# Altium schematic sheet Sheet2.SchDoc
size A1; SheetNumber: 1; SheetTotal: 1
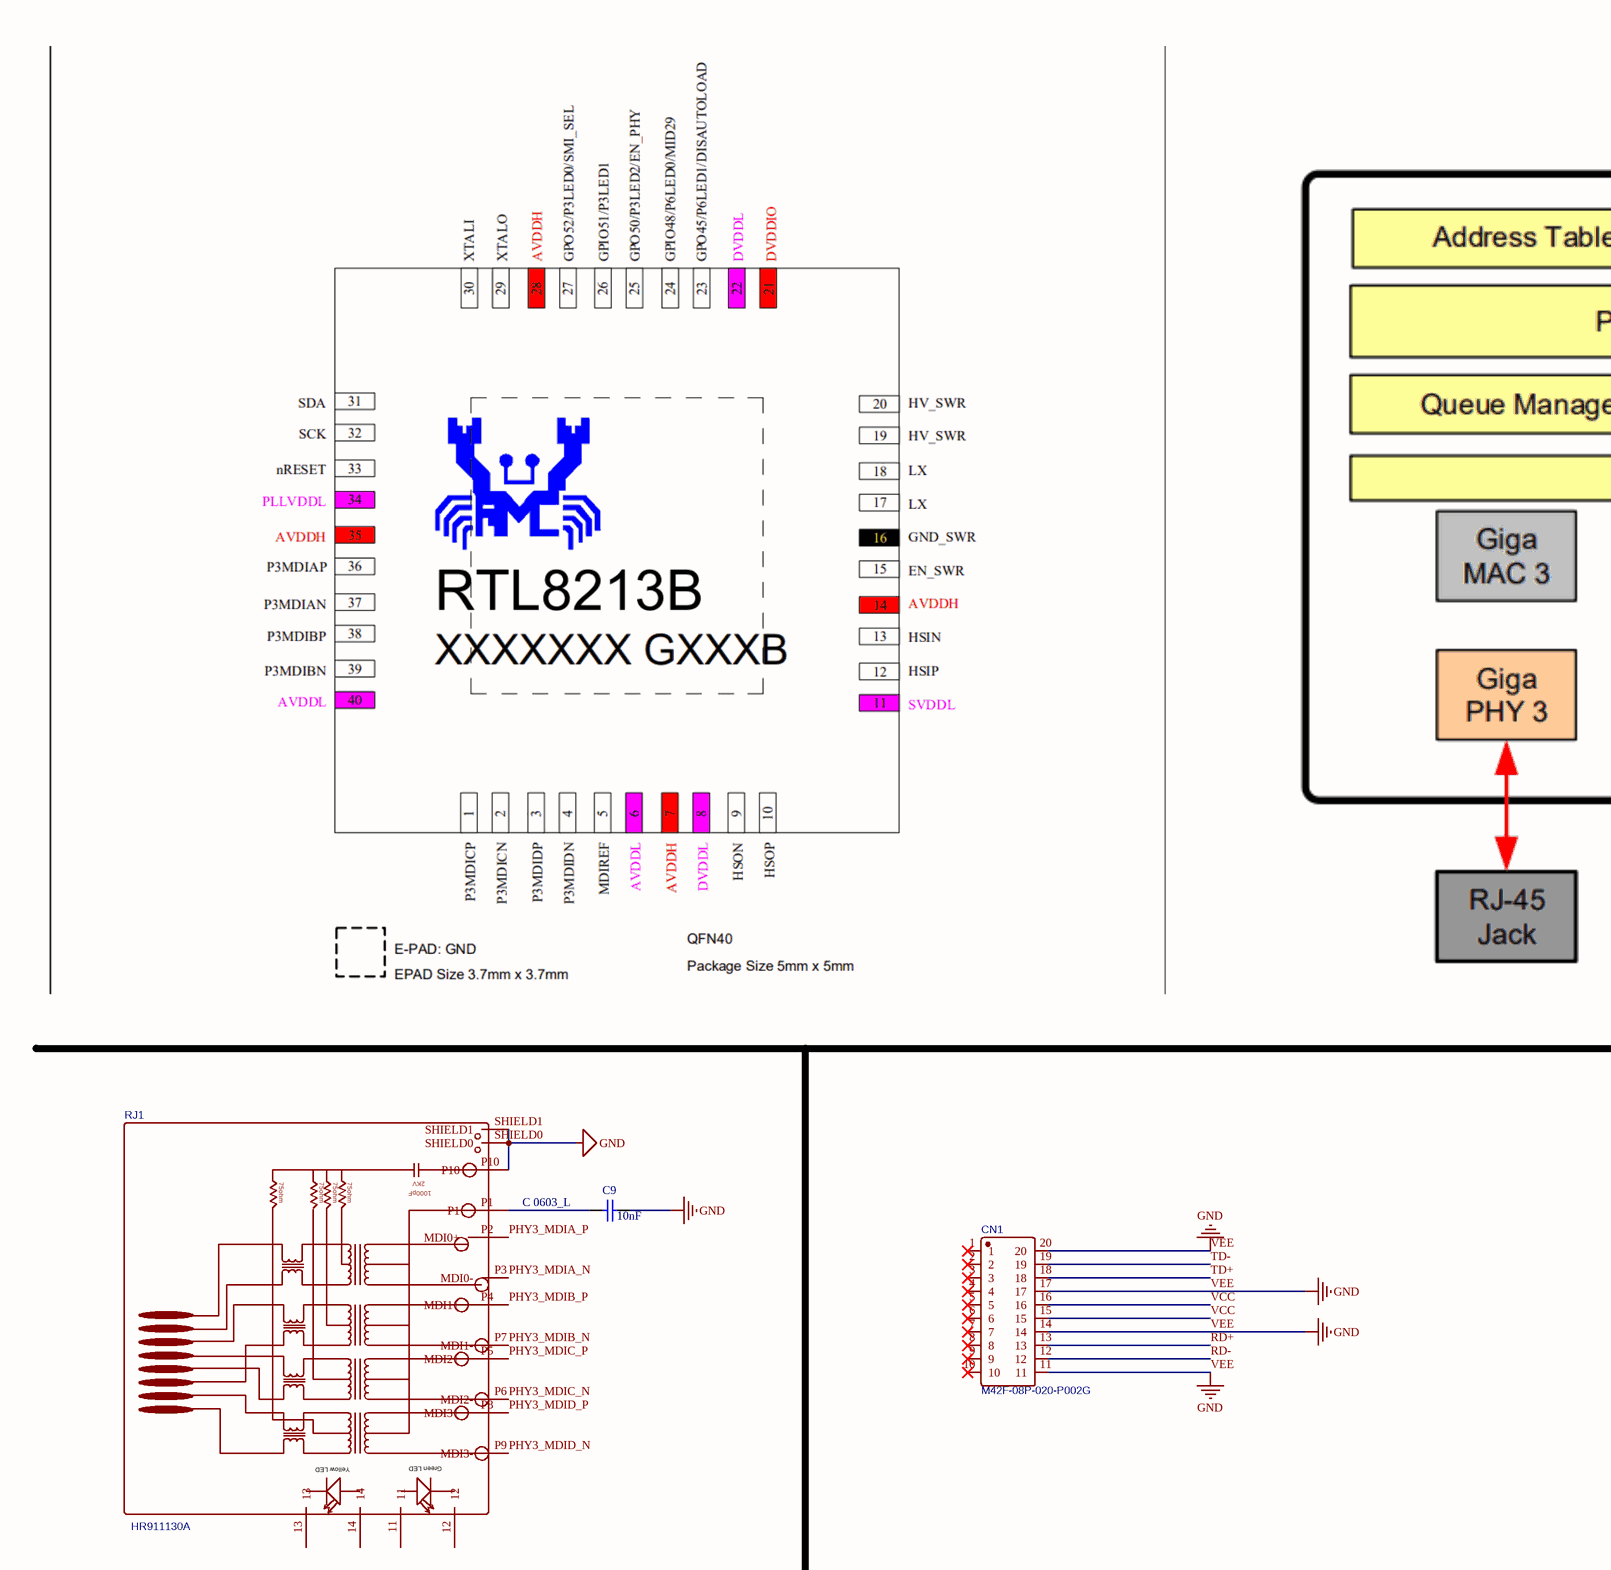
[diagram p0: Sheet2.SchDoc, top left]
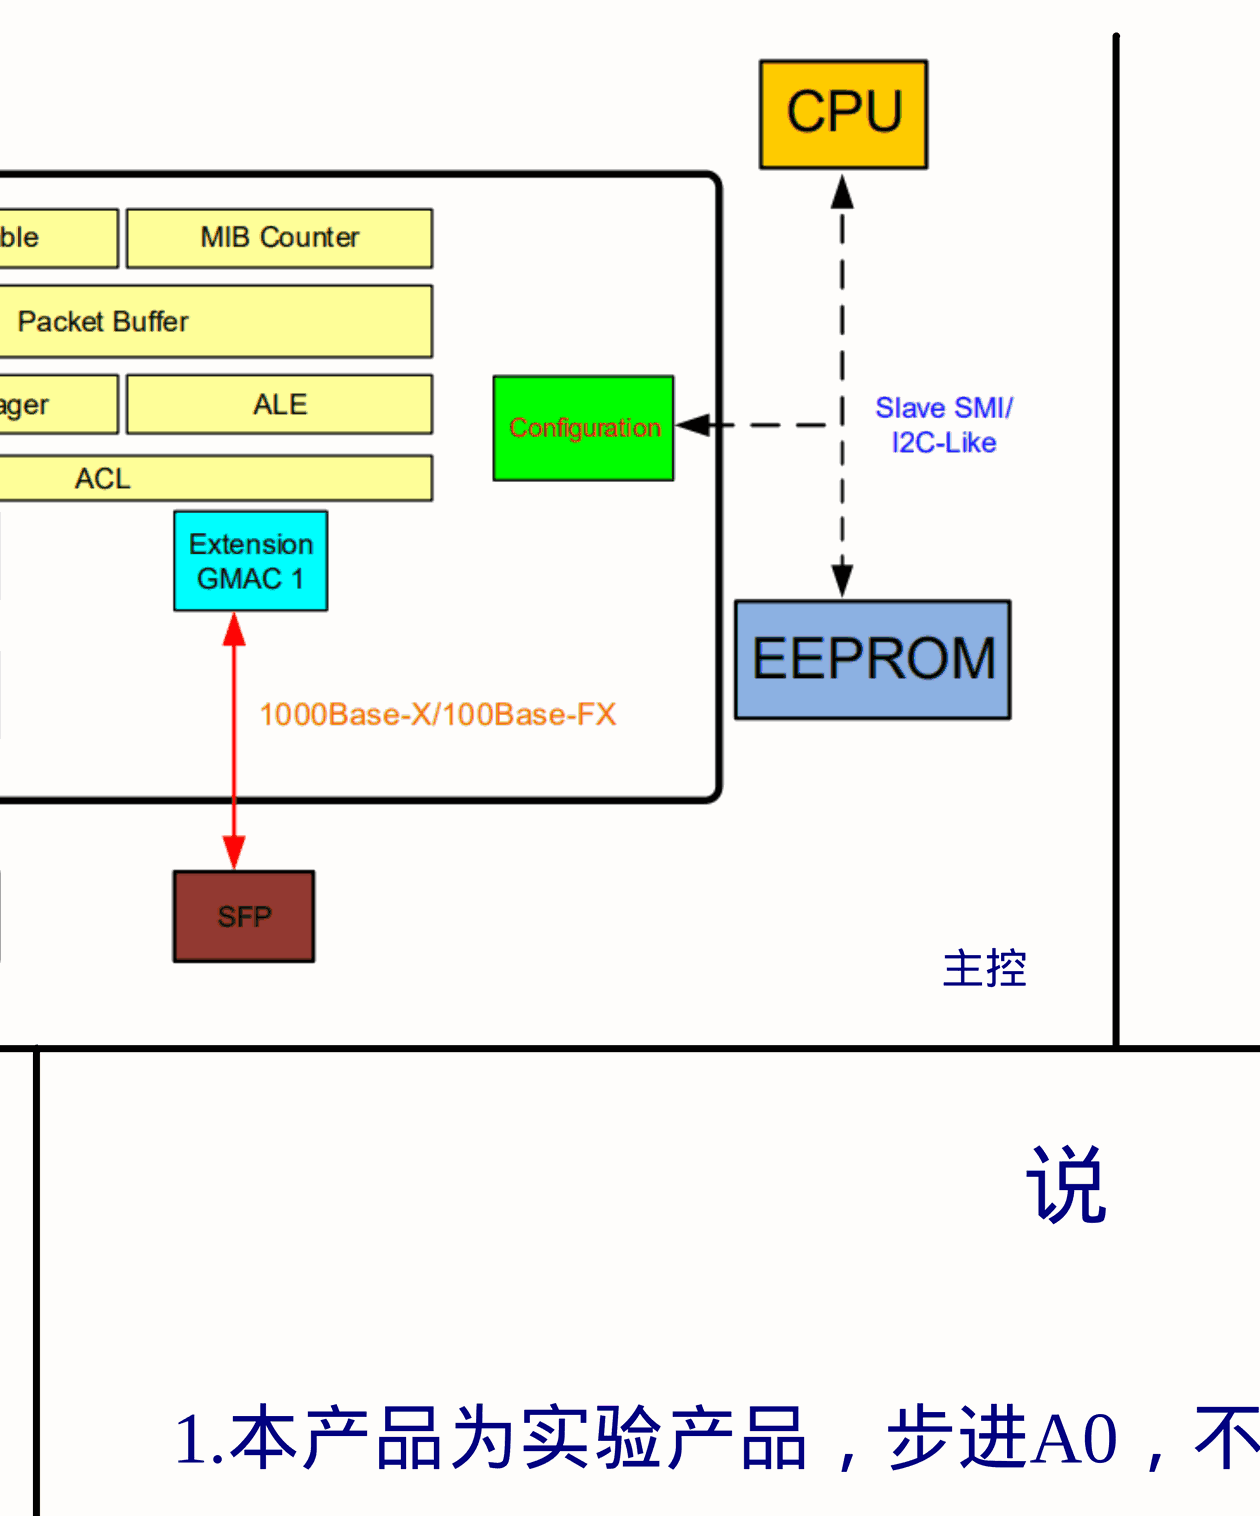
[diagram p1: Sheet2.SchDoc, top middle]
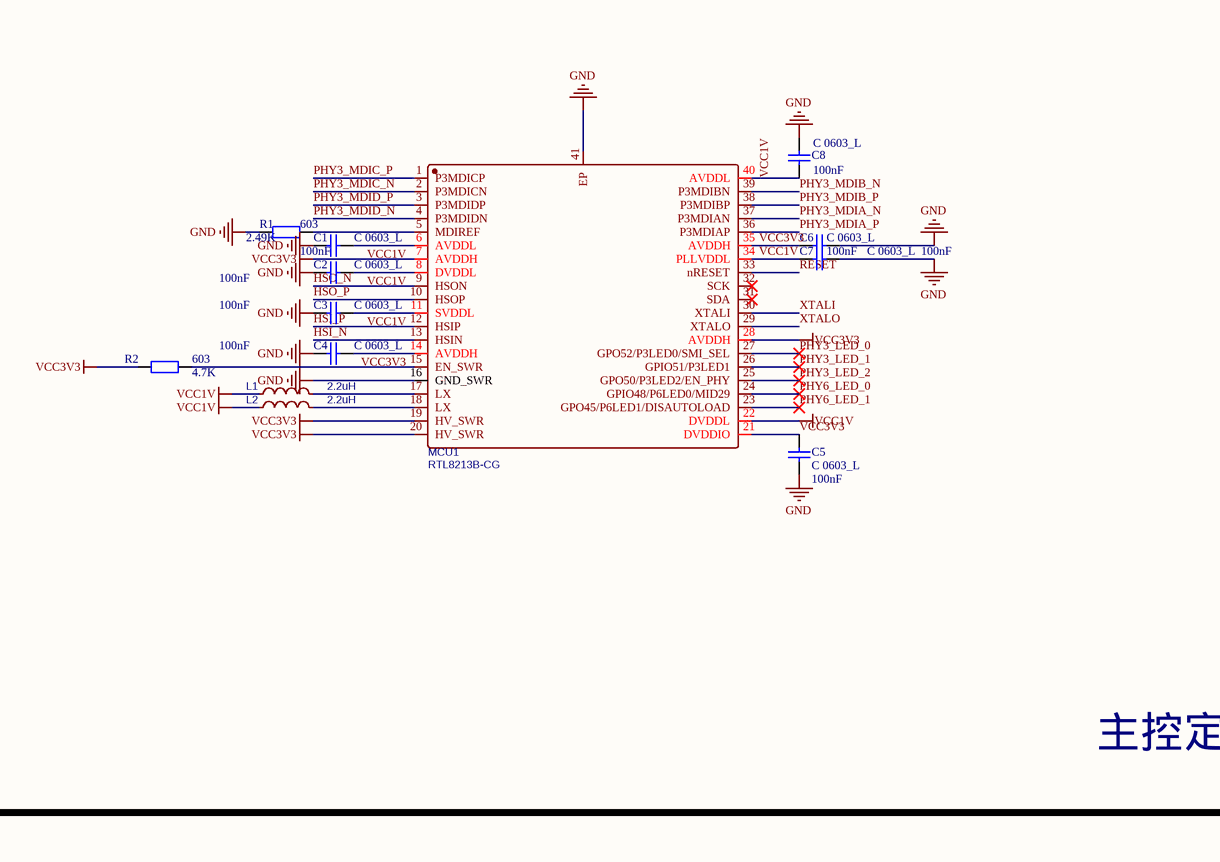
[diagram p2: Sheet2.SchDoc, top right]
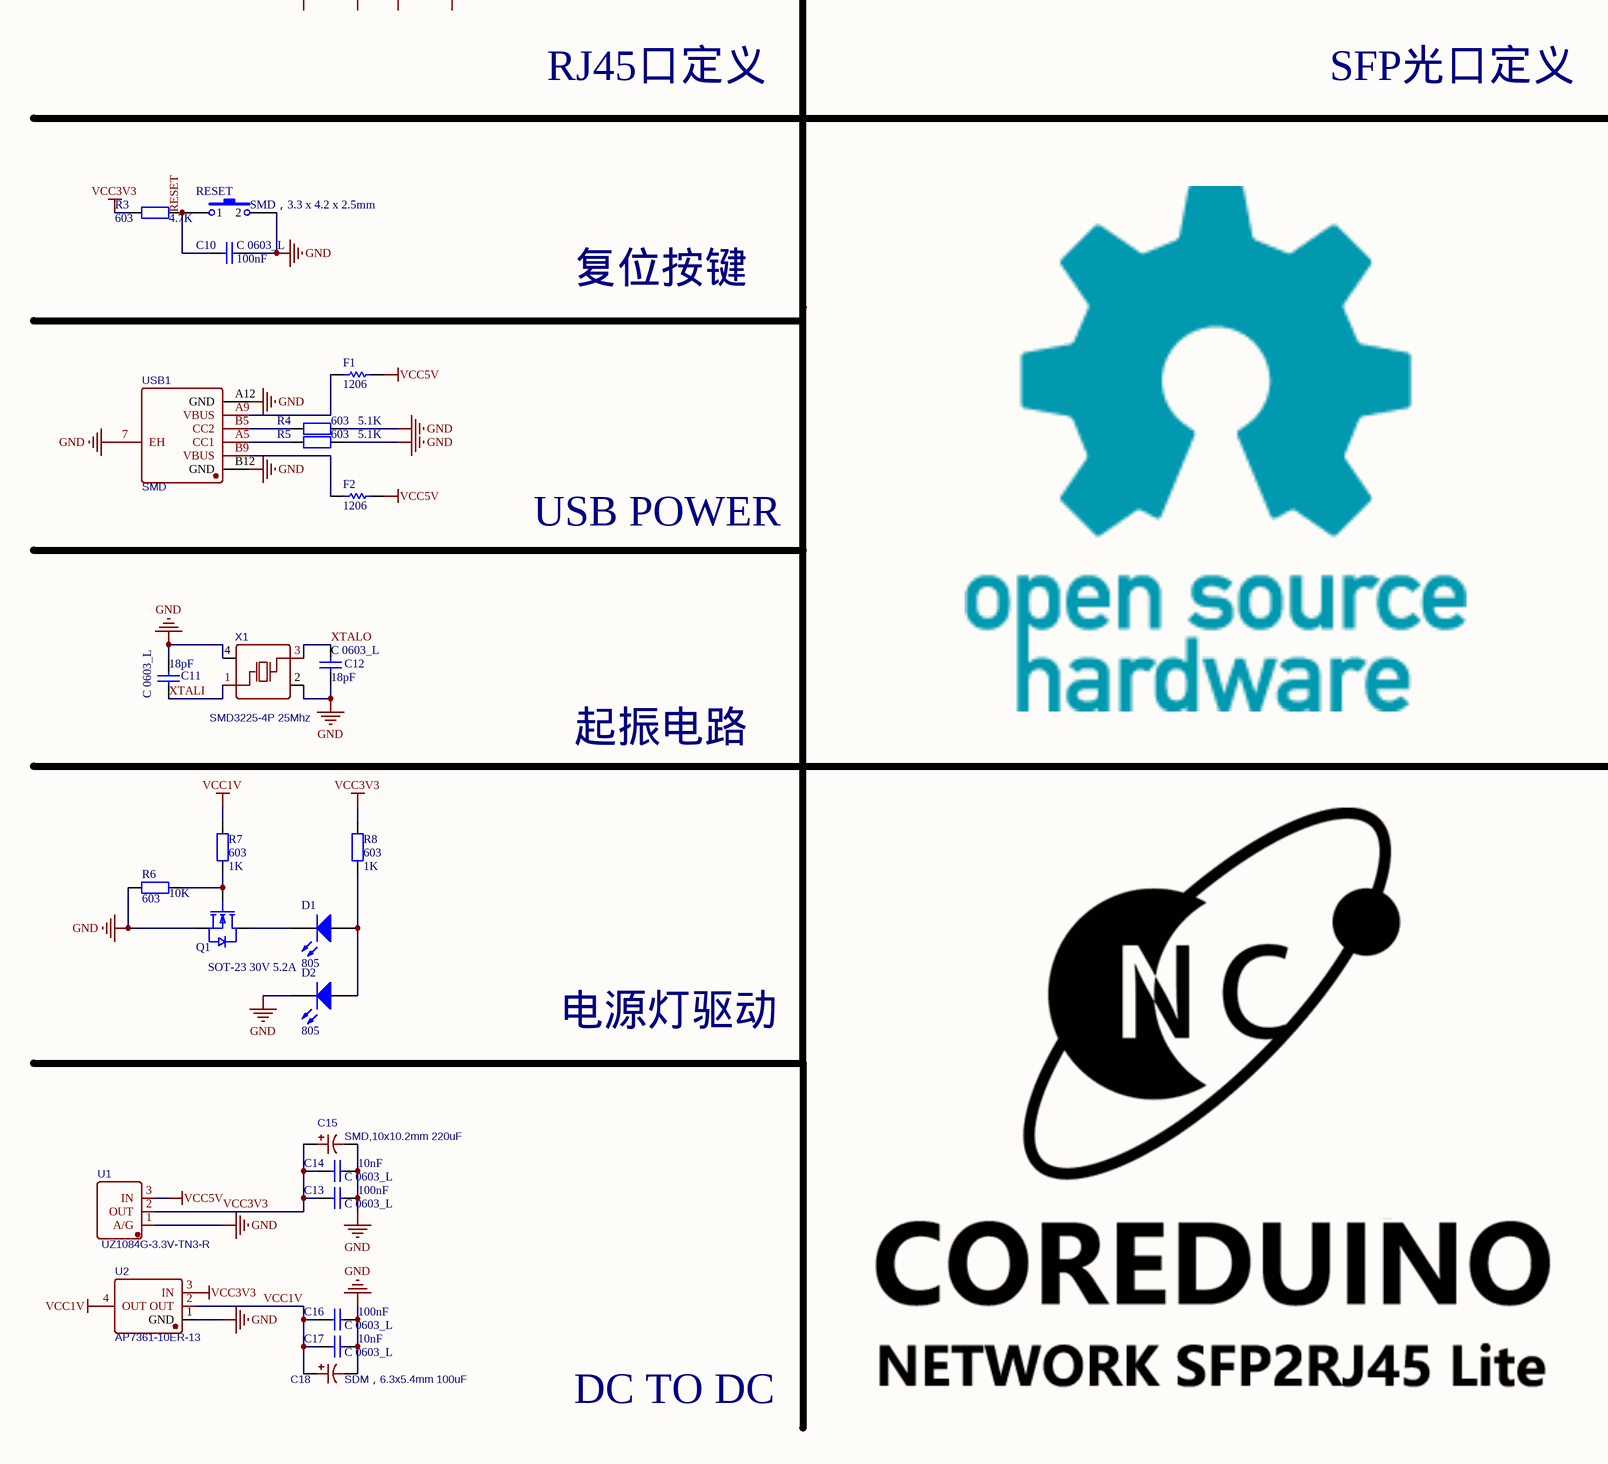
[diagram p3: Sheet2.SchDoc, bottom left]
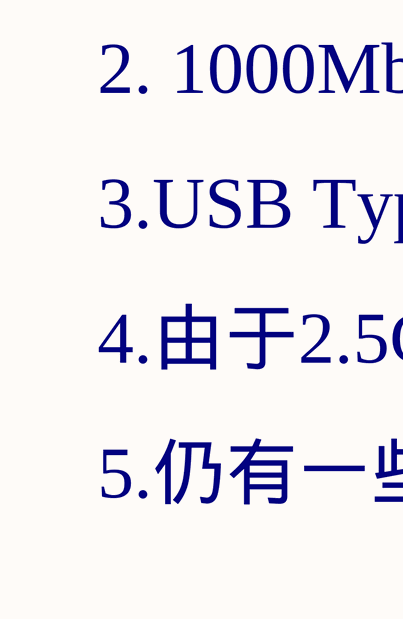
[diagram p4: Sheet2.SchDoc, bottom middle]

## Parts
C1  C 0603_L  value 100nF  [C 0603_L]
C2  C 0603_L  value 100nF  [C 0603_L]
C3  C 0603_L  value 100nF  [C 0603_L]
C4  C 0603_L  value 100nF  [C 0603_L]
C5  C 0603_L  value 100nF  [C 0603_L]
C6  C 0603_L  value 100nF  [C 0603_L]
C7  C 0603_L  value 100nF  [C 0603_L]
C8  C 0603_L  value 100nF  [C 0603_L]
C9  C 0603_L  value 10nF  [C 0603_L]
C10  C 0603_L  value 100nF  [C 0603_L]
C11  C 0603_L  value 18pF  [C 0603_L]
C12  C 0603_L  value 18pF  [C 0603_L]
C13  C 0603_L  value 100nF  [C 0603_L]
C14  C 0603_L  value 10nF  [C 0603_L]
C15  SMD,10x10.2mm 220uF  [CAP-SMD_BD10.0-L10.3-W10.3-LS11.0-FD]
C16  C 0603_L  value 100nF  [C 0603_L]
C17  C 0603_L  value 10nF  [C 0603_L]
C18  SDM，6.3x5.4mm 100uF  [CAP-SMD_BD6.3-L6.6-W6.6-LS7.2-FD]
CN1  M42F-08P-020-P002G  [CONN-SMD_20P-P0.80-H_M42F-08P-020-P002G]
D1  805  [LED 0805G]
D2  805  [LED 0805G]
F1  1206  [FU 1206]
F2  1206  [FU 1206]
L1  2.2uH  [L0603]
L2  2.2uH  [L0603]
MCU1  RTL8213B-CG  [QFN-40_L5.0-W5.0-P0.40-BL-EP3.7]
Q1  SOT-23 30V 5.2A  [AO3400A]
R1  603  value 2.49K  [R 0603_L]
R2  603  value 4.7K  [R 0603_L]
R3  603  value 4.7K  [R 0603_L]
R4  603  value 5.1K  [R 0603_L]
R5  603  value 5.1K  [R 0603_L]
R6  603  value 10K  [R 0603_L]
R7  603  value 1K  [R 0603_L]
R8  603  value 1K  [R 0603_L]
RESET  SMD，3.3 x 4.2 x 2.5mm  [SMD-3.2*4.2]
RJ1  HR911130A  [RJ45-TH_HR911130A]
U1  UZ1084G-3.3V-TN3-R  [TO-252-3_L6.5-W5.8-P4.58-TL]
U2  AP7361-10ER-13  [SOT-223_L6.5-W3.5-P2.30-LS7.0-BR]
USB1  SMD  [TYPE-C-SMD_TYPE-C-6P]
X1  SMD3225-4P 25Mhz  [OSC-SMD_4P-L3.2-W2.5-BL]

## Nets
VCC1V: C1.2 C2.2 C3.2 C7.1 C8.1 C16.1 C17.1 C18.1 L1.1 L2.1 MCU1.6(AVDDL) MCU1.8(DVDDL) MCU1.11(SVDDL) MCU1.22(DVDDL) MCU1.34(PLLVDDL) MCU1.40(AVDDL) R7.2 U2.2(OUT) U2.4(OUT)
VCC3V3: C4.2 C5.1 C6.1 C13.1 C14.1 C15.1 MCU1.7(AVDDH) MCU1.14(AVDDH) MCU1.19(HV_SWR) MCU1.20(HV_SWR) MCU1.21(DVDDIO) MCU1.28(AVDDH) MCU1.35(AVDDH) R2.1 R3.1 R8.2 U1.2(OUT) U2.3(IN)
VCC5V: F1.2 F2.2 U1.3(IN)
VEE: C1.1 C2.1 C3.1 C4.1 C5.2 C6.2 C7.2 C8.2 C9.2 C10.2 C11.2 C12.1 C13.2 C14.2 C15.2 C16.2 C17.2 C18.2 CN1.11 CN1.14 CN1.17 CN1.20 D2.2(K) MCU1.16(GND_SWR) MCU1.41(EP) Q1.2(S) R1.1 R4.2 R5.2 R6.1 RESET.2 RJ1.P10 RJ1.SHIELD0 RJ1.SHIELD1 U1.1(A/G) U2.1(GND) USB1.7(EH) USB1.A12(GND) USB1.B12(GND) X1.2(GND) X1.4(GND)  [also labelled GND]
HSI_N: MCU1.13(HSIN)
HSI_P: MCU1.12(HSIP)
HSO_N: MCU1.9(HSON)
HSO_P: MCU1.10(HSOP)
PHY3_LED_0: MCU1.27(GPO52/P3LED0/SMI_SEL)
PHY3_LED_1: MCU1.26(GPIO51/P3LED1)
PHY3_LED_2: MCU1.25(GPO50/P3LED2/EN_PHY)
PHY3_MDIA_N: MCU1.37(P3MDIAN) RJ1.P3(MDI0-)
PHY3_MDIA_P: MCU1.36(P3MDIAP) RJ1.P2(MDI0+)
PHY3_MDIB_N: MCU1.39(P3MDIBN) RJ1.P7(MDI1-)
PHY3_MDIB_P: MCU1.38(P3MDIBP) RJ1.P4(MDI1+)
PHY3_MDIC_N: MCU1.2(P3MDICN) RJ1.P6(MDI2-)
PHY3_MDIC_P: MCU1.1(P3MDICP) RJ1.P5(MDI2+)
PHY3_MDID_N: MCU1.4(P3MDIDN) RJ1.P9(MDI3-)
PHY3_MDID_P: MCU1.3(P3MDIDP) RJ1.P8(MDI3+)
PHY6_LED_0: MCU1.24(GPIO48/P6LED0/MID29)
PHY6_LED_1: MCU1.23(GPO45/P6LED1/DISAUTOLOAD)
RD+: CN1.13
RD-: CN1.12
RESET: C10.1 MCU1.33(nRESET) R3.2 RESET.1
TD+: CN1.18
TD-: CN1.19
VCC: CN1.15 CN1.16
XTALI: C11.1 MCU1.30(XTALI) X1.1(OSC1)
XTALO: C12.2 MCU1.29(XTALO) X1.3(OSC2)
NetC9_1: C9.1 RJ1.P1
NetD1_1: D1.1(A) D2.1(A) R8.1
NetD1_2: D1.2(K) Q1.3(D)
NetF1_1: F1.1 USB1.A9(VBUS)
NetF2_1: F2.1 USB1.B9(VBUS)
NetL1_2: L1.2 MCU1.17(LX)
NetL2_2: L2.2 MCU1.18(LX)
NetMCU1_5: MCU1.5(MDIREF) R1.2
NetMCU1_15: MCU1.15(EN_SWR) R2.2
NetQ1_1: Q1.1(G) R6.2 R7.1
NetR4_1: R4.1 USB1.B5(CC2)
NetR5_1: R5.1 USB1.A5(CC1)

Not connected (* = marked no-connect by the designer): CN1 1* 2* 3* 4* 5* 6* 7* 8* 9* 10*; MCU1 31(SDA)* 32(SCK)*; RJ1 11 12 13 14

## Notes on the sheet
- 主控
- 主控定义
- 说                        明
- 1.本产品为实验产品，步进A0，不代表最终质量
- 2. 1000Mbps / 100Mbps 自适应
- RJ45口定义
- SFP光口定义
- 3.USB Type-C 供电设计
- 复位按键
- 4.由于2.5G芯片未解密，只能先用1000Mbps的芯片铺路
- 5.仍有一些功能未实现，待后续完善
- USB POWER
- 起振电路
- 电源灯驱动
- DC TO DC
- (in symbol HR911130A) 2KV; 75ohm; 1000pF; J1 TX+; J2 TX-; J3 RX+; J4; J5; J6 RX-; J7; J8; Yellow LED; Green LED

## Library data of the parts
C1-C14 C16 C17 = C 0603_L: 贴片电容器（Capacitor）; Published: 8-Jun-2000; LatestRevisionDate: 17-Jul-2002; LatestRevisionNote: Re-released for DXP Platform.; PackageReference: RAD-0.3; Publisher: Altium Limited; PackageDescription: Radial Cap, Thru-Hole; 2 Leads; 0.3 in Pin Spacing
C15 = RVT220UF50V67RV0021: 贴片铝电解电容器（Capacitor）; BOM_Manufacturer: KNSCHA(科尼盛); nameAlias: Capacitance; Contributor: LCSC; BOM_Supplier: LCSC; BOM_Supplier Part: C2887271; BOM_Manufacturer Part: RVT220UF50V67RV0021; BOM_JLCPCB Part Class: Extended Part; spicePre: C; spiceSymbolName: RVT220UF50V67RV0021
C18 = RVT100UF16V67RV0016: 贴片铝电解电容器（Capacitor）; BOM_Manufacturer: KNSCHA(科尼盛); nameAlias: Capacitance; Contributor: LCSC; BOM_Supplier: LCSC; BOM_Supplier Part: C2887276; BOM_Manufacturer Part: RVT100UF16V67RV0016; BOM_JLCPCB Part Class: Extended Part; spicePre: C; spiceSymbolName: RVT100UF16V67RV0016
CN1 = M42F-08P-020-P002G: SFP+万兆光模块口（SFP+ Jack）; BOM_Manufacturer: UMAX; Contributor: LCSC; BOM_Supplier: LCSC; BOM_Supplier Part: C404107; BOM_Manufacturer Part: M42F-08P-020-P002G; BOM_JLCPCB Part Class: Extended Part; spicePre: C; spiceSymbolName: M42F-08P-020-P002G
D1 D2 = LED 0805G 绿: 贴片发光二极管（LED）; Published: 8-Jun-2000; LatestRevisionDate: 08-Jul-2005; LatestRevisionNote: Mech Layer 1 removed.; PackageReference: LED-0; Publisher: Altium Limited; PackageDescription: LED; 2 Leads
F1 F2 = nsmd150: 自恢复保险丝（Fuse）; Published: 8-Jun-2000; LatestRevisionDate: 17-Jul-2002; LatestRevisionNote: Re-released for DXP Platform.; PackageReference: AXIAL-0.3; Publisher: Altium Limited; PackageDescription: Axial Device, Thru-Hole; 2 Leads; 0.3 in Pin Spacing
L1 L2 = SDFL1608Q2R2KTF: 贴片电感（Inductors）; BOM_Manufacturer: Sunlord; nameAlias: Inductance; BOM_Supplier: LCSC; BOM_Manufacturer Part: SDFL1608Q2R2KTF; BOM_Supplier Part: C1033; BOM_JLCPCB Part Class: Extended Part; spicePre: L; spiceSymbolName: SDFL1608Q2R2KTF
MCU1 = RTL8213B-CG: 以太网转换芯片（Network）; BOM_Manufacturer: REALTEK(瑞昱); Contributor: LCSC; BOM_Supplier: LCSC; BOM_Supplier Part: C2766076; BOM_Manufacturer Part: RTL8213B-CG; BOM_JLCPCB Part Class: Extended Part; spicePre: U; spiceSymbolName: RTL8213B-CG
Q1 = AO3400A: 场效应管（MOSFET）; Manufacturer: Nexperia(安世); Symbol: 2N7002,215; Add into BOM: yes; Type: N沟道; Drain Source Voltage (Vdss): 60V; Continuous Drain Current (Id): 300mA; Power Dissipation (Pd): 830mW; Drain Source On Resistance (RDS(on)@Vgs,Id): 5Ω@10V,500mA; Gate Threshold Voltage (Vgs(th)@Id): 2.5V@250A; Device: 2N7002,215; LCSC Part Name: N沟道 60V 300mA; Supplier Part: C65189; Manufacturer Part: 2N7002,215; Supplier Footprint: SOT-23(SOT-23-3); JLCPCB Part Class: Extended Part; Datasheet: https://atta.szlcsc.com/upload/public/pdf/source/20170103/1483439882638.pdf; Supplier: LCSC; Convert to PCB: yes
R1-R8 = R 0603_L: 贴片电阻（Resistor）; Published: 8-Jun-2000; LatestRevisionDate: 17-Jul-2002; LatestRevisionNote: Re-released for DXP Platform.; PackageReference: AXIAL-0.4; Publisher: Altium Limited; PackageDescription: Axial Device, Thru-Hole; 2 Leads; 0.4 in Pin Spacing
RESET = 260GF: 轻触开关（Touch Switch）; Published: 24-Mar-1999; LatestRevisionDate: 17-Jul-2002; LatestRevisionNote: Re-released for DXP Platform.; PackageReference: SPST-2; Publisher: Altium Limited; PackageDescription: Switch; 2 Leads
RJ1 = HR911130A: 单插带灯以太网接口（RJ45）; BOM_Manufacturer: HANRUN; BOM_Supplier: LCSC; BOM_Manufacturer Part: HR911130A; BOM_Supplier Part: C54408; BOM_JLCPCB Part Class: Extended Part; spicePre: R; spiceSymbolName: HR911130A
U1 = UZ1084G-3.3V-TN3-R: 线性稳压器（LDO）; BOM_Manufacturer: UTC; BOM_Supplier: LCSC; BOM_Manufacturer Part: UZ1084G-3.3V-TN3-R; BOM_Supplier Part: C84897; BOM_JLCPCB Part Class: Extended Part; spicePre: U; spiceSymbolName: UZ1084G-3.3V-TN3-R
U2 = AP7361-10ER-13: 线性稳压器（LDO）; BOM_Manufacturer: Diodes Incorporated; Contributor: LCSC; BOM_Supplier: LCSC; BOM_Supplier Part: C460389; BOM_Manufacturer Part: AP7361-10ER-13; BOM_JLCPCB Part Class: Extended Part; spicePre: U; spiceSymbolName: AP7361-10ER-13
USB1 = TYPE-C 6P QT: 通用通信总线接口（USB）; BOM_Manufacturer: SHOU HAN; Contributor: LCSC; BOM_Supplier: LCSC; BOM_Supplier Part: C456012; BOM_Manufacturer Part: TYPE-C 6P; BOM_JLCPCB Part Class: Extended Part; spicePre: U; spiceSymbolName: TYPE-C 6P
X1 = XXCEELNANF-25MHZ: 无源晶振（Crystal）; BOM_Manufacturer: TAITIEN Elec; nameAlias: Frequency; Contributor: LCSC; BOM_Supplier: LCSC; BOM_Supplier Part: C117869; BOM_Manufacturer Part: XXCEELNANF-25MHZ; BOM_JLCPCB Part Class: Extended Part; spicePre: X; spiceSymbolName: XXCEELNANF-25MHZ